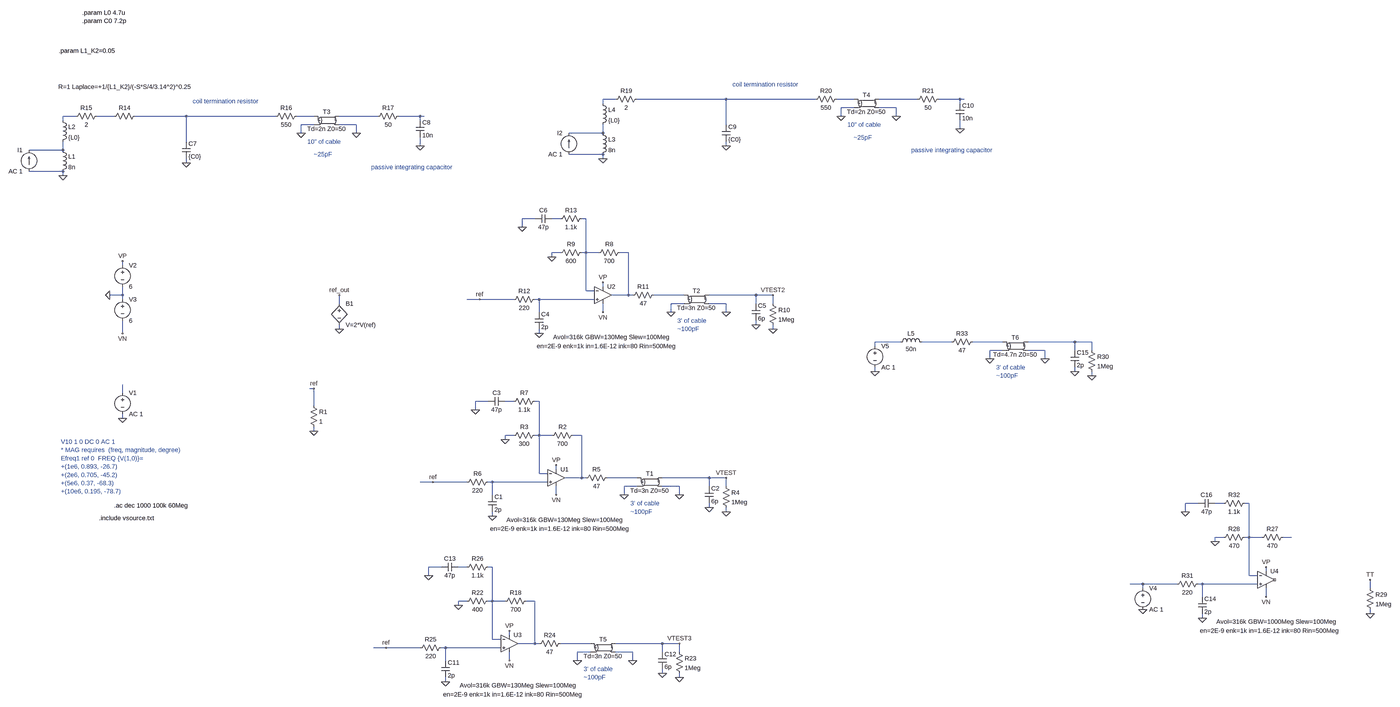
[diagram p0: schematic compensation.asc, whole sheet]
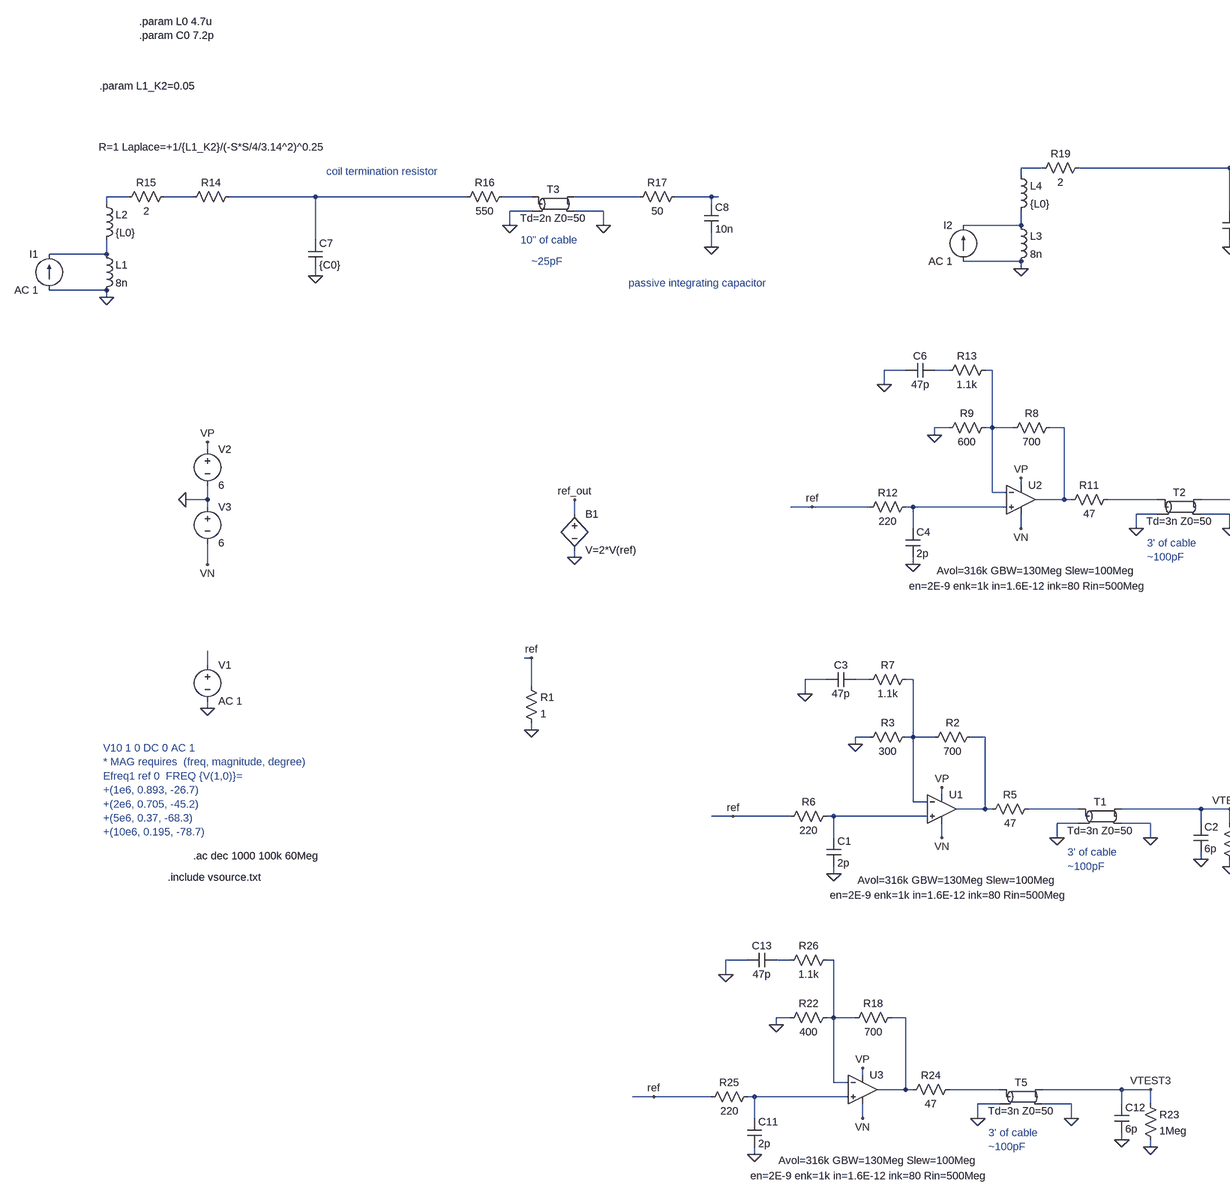
[diagram p1: schematic compensation.asc, part, row 1 of 1, column 1 of 2]
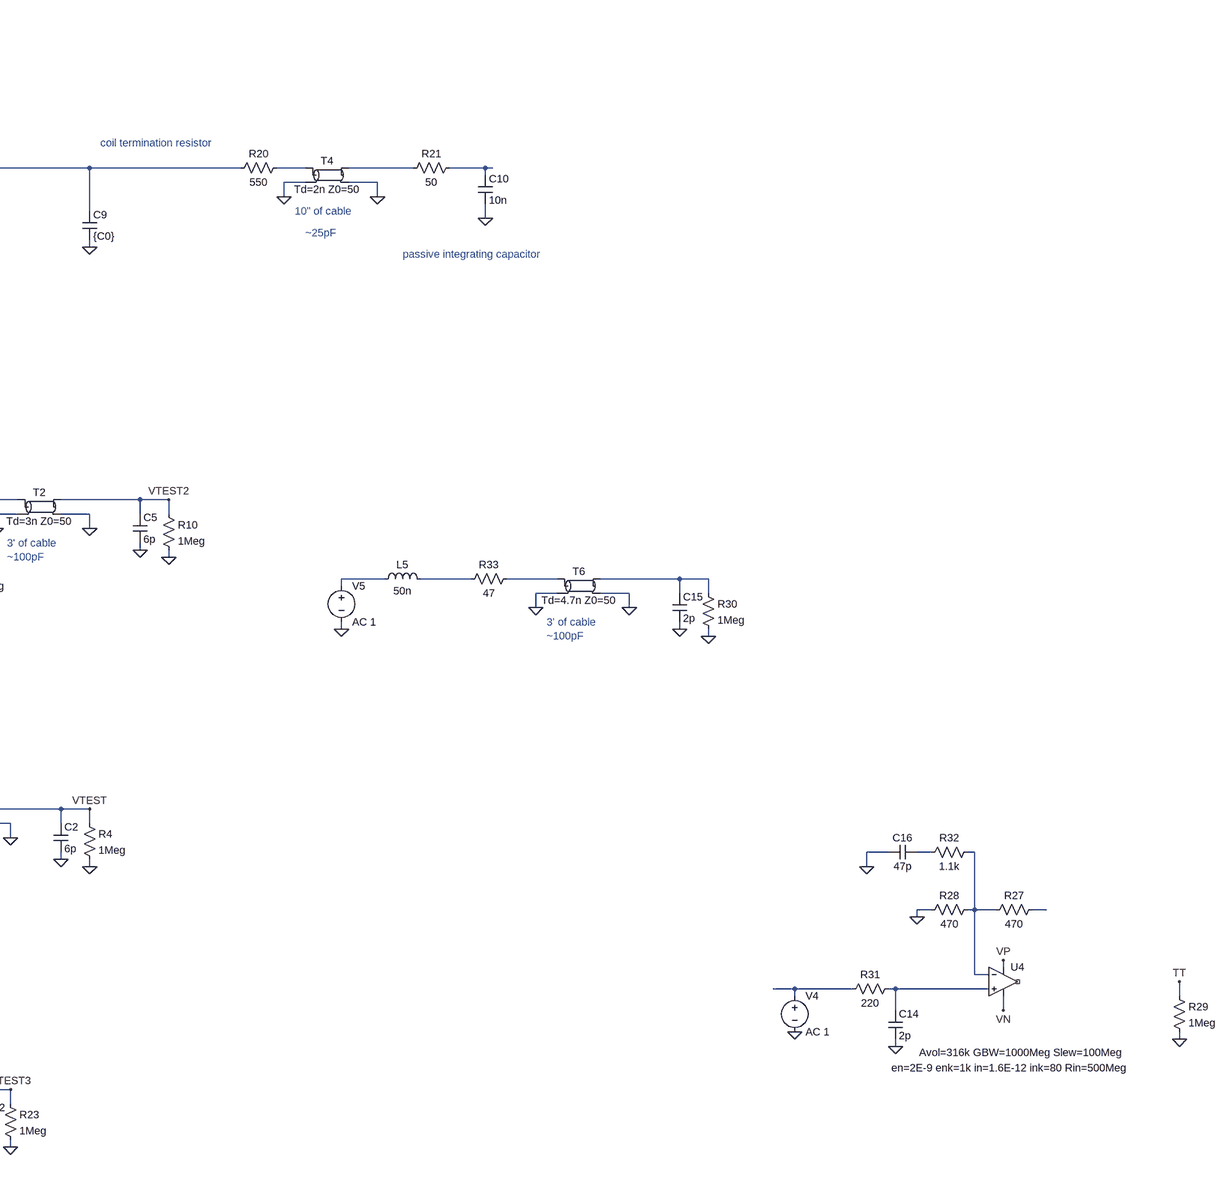
[diagram p2: schematic compensation.asc, part, row 1 of 1, column 2 of 2]
compensation.asc, the LTspice schematic file:
Version 4
SHEET 1 4888 992
WIRE 1712 -1616 1664 -1616
WIRE 2128 -1616 1792 -1616
WIRE 2464 -1616 2128 -1616
WIRE 2608 -1616 2544 -1616
WIRE 2848 -1616 2704 -1616
WIRE 3008 -1616 2928 -1616
WIRE 3024 -1616 3008 -1616
WIRE 1664 -1600 1664 -1616
WIRE 3008 -1600 3008 -1616
WIRE 2608 -1584 2560 -1584
WIRE 2768 -1584 2704 -1584
WIRE -320 -1552 -368 -1552
WIRE -176 -1552 -240 -1552
WIRE 96 -1552 -96 -1552
WIRE 432 -1552 96 -1552
WIRE 576 -1552 512 -1552
WIRE 816 -1552 672 -1552
WIRE 976 -1552 896 -1552
WIRE 992 -1552 976 -1552
WIRE 2560 -1552 2560 -1584
WIRE 2768 -1552 2768 -1584
WIRE -368 -1536 -368 -1552
WIRE 976 -1536 976 -1552
WIRE 576 -1520 528 -1520
WIRE 736 -1520 672 -1520
WIRE 2128 -1520 2128 -1616
WIRE 3008 -1504 3008 -1536
WIRE 528 -1488 528 -1520
WIRE 736 -1488 736 -1520
WIRE 1664 -1488 1664 -1520
WIRE 1664 -1488 1536 -1488
WIRE 96 -1456 96 -1552
WIRE 976 -1440 976 -1472
WIRE 2128 -1440 2128 -1456
WIRE -368 -1424 -368 -1456
WIRE -368 -1424 -496 -1424
WIRE 1664 -1408 1536 -1408
WIRE 1664 -1392 1664 -1408
WIRE 96 -1376 96 -1392
WIRE -368 -1344 -496 -1344
WIRE -368 -1328 -368 -1344
WIRE 1408 -816 1360 -816
WIRE 1504 -816 1472 -816
WIRE 1600 -816 1584 -816
WIRE 1360 -784 1360 -816
WIRE 1504 -688 1472 -688
WIRE 1600 -688 1600 -816
WIRE 1600 -688 1584 -688
WIRE 1648 -688 1600 -688
WIRE 1760 -688 1728 -688
WIRE 1472 -672 1472 -688
WIRE -144 -640 -144 -656
WIRE 1664 -560 1664 -576
WIRE 1600 -544 1600 -688
WIRE 1632 -544 1600 -544
WIRE -144 -528 -144 -560
WIRE -144 -528 -192 -528
WIRE 1760 -528 1760 -688
WIRE 1760 -528 1696 -528
WIRE 1776 -528 1760 -528
WIRE 1968 -528 1856 -528
WIRE 2240 -528 2064 -528
WIRE 2304 -528 2240 -528
WIRE -144 -512 -144 -528
WIRE 1200 -512 1152 -512
WIRE 1328 -512 1200 -512
WIRE 1424 -512 1408 -512
WIRE 1632 -512 1424 -512
WIRE 672 -496 672 -528
WIRE 1968 -496 1920 -496
WIRE 2128 -496 2064 -496
WIRE 2240 -496 2240 -528
WIRE 2304 -496 2304 -528
WIRE 1424 -464 1424 -512
WIRE 1664 -464 1664 -496
WIRE 1920 -464 1920 -496
WIRE 2128 -464 2128 -496
WIRE 2240 -416 2240 -432
WIRE 672 -400 672 -416
WIRE 2304 -400 2304 -416
WIRE -144 -384 -144 -432
WIRE 1424 -384 1424 -400
WIRE 2784 -352 2688 -352
WIRE 2976 -352 2864 -352
WIRE 3168 -352 3056 -352
WIRE 3440 -352 3264 -352
WIRE 3504 -352 3440 -352
WIRE 2688 -336 2688 -352
WIRE 3168 -320 3120 -320
WIRE 3328 -320 3264 -320
WIRE 3440 -320 3440 -352
WIRE 3504 -320 3504 -352
WIRE 3120 -288 3120 -320
WIRE 3328 -288 3328 -320
WIRE 2688 -240 2688 -256
WIRE 3440 -240 3440 -256
WIRE 3504 -224 3504 -240
WIRE 576 -176 560 -176
WIRE -144 -160 -144 -192
WIRE 1232 -128 1184 -128
WIRE 1328 -128 1296 -128
WIRE 1424 -128 1408 -128
WIRE 576 -112 576 -176
WIRE 1184 -96 1184 -128
WIRE -144 -64 -144 -80
WIRE 576 -16 576 -32
WIRE 1328 0 1296 0
WIRE 1424 0 1424 -128
WIRE 1424 0 1408 0
WIRE 1472 0 1424 0
WIRE 1584 0 1552 0
WIRE 1296 16 1296 0
WIRE 1488 128 1488 112
WIRE 1424 144 1424 0
WIRE 1456 144 1424 144
WIRE 1584 160 1584 0
WIRE 1584 160 1520 160
WIRE 1600 160 1584 160
WIRE 1792 160 1680 160
WIRE 2064 160 1888 160
WIRE 2128 160 2064 160
WIRE 1024 176 976 176
WIRE 1152 176 1024 176
WIRE 1248 176 1232 176
WIRE 1456 176 1248 176
WIRE 1792 192 1744 192
WIRE 1952 192 1888 192
WIRE 2064 192 2064 160
WIRE 2128 192 2128 160
WIRE 1248 224 1248 176
WIRE 1488 224 1488 192
WIRE 1744 224 1744 192
WIRE 1952 224 1952 192
WIRE 3904 256 3856 256
WIRE 4000 256 3968 256
WIRE 4096 256 4080 256
WIRE 2064 272 2064 256
WIRE 2128 288 2128 272
WIRE 3856 288 3856 256
WIRE 1248 304 1248 288
WIRE 4000 384 3968 384
WIRE 4096 384 4096 256
WIRE 4096 384 4080 384
WIRE 4144 384 4096 384
WIRE 4256 384 4224 384
WIRE 3968 400 3968 384
WIRE 1056 496 1008 496
WIRE 1152 496 1120 496
WIRE 1248 496 1232 496
WIRE 4160 512 4160 496
WIRE 1008 528 1008 496
WIRE 4096 528 4096 384
WIRE 4128 528 4096 528
WIRE 3696 560 3648 560
WIRE 3824 560 3696 560
WIRE 3920 560 3904 560
WIRE 4128 560 3920 560
WIRE 3696 576 3696 560
WIRE 4800 576 4800 544
WIRE 3920 608 3920 560
WIRE 4160 608 4160 576
WIRE 1152 624 1120 624
WIRE 1248 624 1248 496
WIRE 1248 624 1232 624
WIRE 1296 624 1248 624
WIRE 1408 624 1376 624
WIRE 1120 640 1120 624
WIRE 4800 672 4800 656
WIRE 3920 688 3920 672
WIRE 1312 752 1312 736
WIRE 1248 768 1248 624
WIRE 1280 768 1248 768
WIRE 1408 784 1408 624
WIRE 1408 784 1344 784
WIRE 1424 784 1408 784
WIRE 1616 784 1504 784
WIRE 1888 784 1712 784
WIRE 1952 784 1888 784
WIRE 848 800 800 800
WIRE 976 800 848 800
WIRE 1072 800 1056 800
WIRE 1280 800 1072 800
WIRE 1616 816 1568 816
WIRE 1776 816 1712 816
WIRE 1888 816 1888 784
WIRE 1952 816 1952 784
WIRE 1072 848 1072 800
WIRE 1312 848 1312 816
WIRE 1568 848 1568 816
WIRE 1776 848 1776 816
WIRE 1888 896 1888 880
WIRE 1952 912 1952 896
WIRE 1072 928 1072 912
FLAG -144 -64 0
FLAG 576 -16 0
FLAG 576 -176 ref
FLAG 1488 112 VP
FLAG 1488 224 VN
FLAG 1248 304 0
FLAG 1296 16 0
FLAG 2128 160 VTEST
FLAG 1744 224 0
FLAG 1952 224 0
FLAG 2064 272 0
FLAG 2128 288 0
FLAG 1184 -96 0
FLAG 1024 176 ref
FLAG -192 -528 0
FLAG -144 -656 VP
FLAG -144 -384 VN
FLAG 672 -400 0
FLAG 672 -528 ref_out
FLAG 1664 -576 VP
FLAG 1664 -464 VN
FLAG 1424 -384 0
FLAG 1472 -672 0
FLAG 2304 -528 VTEST2
FLAG 1920 -464 0
FLAG 2128 -464 0
FLAG 2240 -416 0
FLAG 2304 -400 0
FLAG 1360 -784 0
FLAG 1200 -512 ref
FLAG 96 -1376 0
FLAG -368 -1328 0
FLAG 528 -1488 0
FLAG 736 -1488 0
FLAG 976 -1440 0
FLAG 2128 -1440 0
FLAG 1664 -1392 0
FLAG 2560 -1552 0
FLAG 2768 -1552 0
FLAG 3008 -1504 0
FLAG 1312 736 VP
FLAG 1312 848 VN
FLAG 1072 928 0
FLAG 1120 640 0
FLAG 1952 784 VTEST3
FLAG 1568 848 0
FLAG 1776 848 0
FLAG 1888 896 0
FLAG 1952 912 0
FLAG 1008 528 0
FLAG 848 800 ref
FLAG 4160 496 VP
FLAG 4160 608 VN
FLAG 3920 688 0
FLAG 3968 400 0
FLAG 4800 544 TT
FLAG 4800 672 0
FLAG 3856 288 0
FLAG 3696 656 0
FLAG 3120 -288 0
FLAG 3328 -288 0
FLAG 3440 -240 0
FLAG 3504 -224 0
FLAG 2688 -240 0
SYMBOL voltage -144 -176 R0
WINDOW 123 0 0 Left 0
WINDOW 39 0 0 Left 0
SYMATTR InstName V1
SYMATTR Value AC 1
SYMBOL res 560 -128 R0
SYMATTR InstName R1
SYMATTR Value 1
SYMBOL cap 1232 224 R0
SYMATTR InstName C1
SYMATTR Value 2p
SYMBOL res 1568 -16 R90
WINDOW 0 0 56 VBottom 2
WINDOW 3 32 56 VTop 2
SYMATTR InstName R2
SYMATTR Value 700
SYMBOL res 1424 -16 R90
WINDOW 0 0 56 VBottom 2
WINDOW 3 32 56 VTop 2
SYMATTR InstName R3
SYMATTR Value 300
SYMBOL tline 1840 176 R0
SYMATTR InstName T1
SYMATTR Value Td=3n Z0=50
SYMBOL res 2112 176 R0
SYMATTR InstName R4
SYMATTR Value 1Meg
SYMBOL cap 2048 192 R0
SYMATTR InstName C2
SYMATTR Value 6p
SYMBOL res 1696 144 R90
WINDOW 0 0 56 VBottom 2
WINDOW 3 32 56 VTop 2
SYMATTR InstName R5
SYMATTR Value 47
SYMBOL OpAmps\\UniversalOpamp2 1488 160 R0
WINDOW 123 -187 158 Left 2
WINDOW 40 -249 192 Left 2
SYMATTR Value2 Avol=316k GBW=130Meg Slew=100Meg
SYMATTR SpiceLine2 en=2E-9 enk=1k in=1.6E-12 ink=80 Rin=500Meg
SYMATTR InstName U1
SYMATTR SpiceLine ilimit=80m rail=0 Vos=0 phimargin=45
SYMBOL res 1248 160 R90
WINDOW 0 0 56 VBottom 2
WINDOW 3 32 56 VTop 2
SYMATTR InstName R6
SYMATTR Value 220
SYMBOL res 1424 -144 R90
WINDOW 0 0 56 VBottom 2
WINDOW 3 32 56 VTop 2
SYMATTR InstName R7
SYMATTR Value 1.1k
SYMBOL cap 1296 -144 R90
WINDOW 0 0 32 VBottom 2
WINDOW 3 32 32 VTop 2
SYMATTR InstName C3
SYMATTR Value 47p
SYMBOL voltage -144 -656 R0
WINDOW 123 0 0 Left 0
WINDOW 39 0 0 Left 0
SYMATTR InstName V2
SYMATTR Value 6
SYMBOL voltage -144 -528 R0
WINDOW 123 0 0 Left 0
WINDOW 39 0 0 Left 0
SYMATTR InstName V3
SYMATTR Value 6
SYMBOL bv 672 -512 R0
SYMATTR InstName B1
SYMATTR Value V=2*V(ref)
SYMBOL cap 1408 -464 R0
SYMATTR InstName C4
SYMATTR Value 2p
SYMBOL res 1744 -704 R90
WINDOW 0 0 56 VBottom 2
WINDOW 3 32 56 VTop 2
SYMATTR InstName R8
SYMATTR Value 700
SYMBOL res 1600 -704 R90
WINDOW 0 0 56 VBottom 2
WINDOW 3 32 56 VTop 2
SYMATTR InstName R9
SYMATTR Value 600
SYMBOL tline 2016 -512 R0
SYMATTR InstName T2
SYMATTR Value Td=3n Z0=50
SYMBOL res 2288 -512 R0
SYMATTR InstName R10
SYMATTR Value 1Meg
SYMBOL cap 2224 -496 R0
SYMATTR InstName C5
SYMATTR Value 6p
SYMBOL res 1872 -544 R90
WINDOW 0 0 56 VBottom 2
WINDOW 3 32 56 VTop 2
SYMATTR InstName R11
SYMATTR Value 47
SYMBOL OpAmps\\UniversalOpamp2 1664 -528 R0
WINDOW 123 -187 158 Left 2
WINDOW 40 -249 192 Left 2
SYMATTR Value2 Avol=316k GBW=130Meg Slew=100Meg
SYMATTR SpiceLine2 en=2E-9 enk=1k in=1.6E-12 ink=80 Rin=500Meg
SYMATTR InstName U2
SYMATTR SpiceLine ilimit=80m rail=0 Vos=0 phimargin=45
SYMBOL res 1424 -528 R90
WINDOW 0 0 56 VBottom 2
WINDOW 3 32 56 VTop 2
SYMATTR InstName R12
SYMATTR Value 220
SYMBOL res 1600 -832 R90
WINDOW 0 0 56 VBottom 2
WINDOW 3 32 56 VTop 2
SYMATTR InstName R13
SYMATTR Value 1.1k
SYMBOL cap 1472 -832 R90
WINDOW 0 0 32 VBottom 2
WINDOW 3 32 32 VTop 2
SYMATTR InstName C6
SYMATTR Value 47p
SYMBOL res -80 -1568 R90
WINDOW 0 0 56 VBottom 2
WINDOW 3 -110 55 VTop 2
SYMATTR InstName R14
SYMATTR Value R=1 Laplace=+1/{L1_K2}/(-S*S/4/3.14^2)^0.25
SYMBOL res -224 -1568 R90
WINDOW 0 0 56 VBottom 2
WINDOW 3 32 56 VTop 2
SYMATTR InstName R15
SYMATTR Value 2
SYMBOL ind -384 -1440 R0
SYMATTR InstName L1
SYMATTR Value 8n
SYMATTR SpiceLine Rser=0
SYMBOL ind -384 -1552 R0
SYMATTR InstName L2
SYMATTR Value {L0}
SYMBOL cap 80 -1456 R0
SYMATTR InstName C7
SYMATTR Value {C0}
SYMBOL res 528 -1568 R90
WINDOW 0 0 56 VBottom 2
WINDOW 3 32 56 VTop 2
SYMATTR InstName R16
SYMATTR Value 550
SYMBOL res 912 -1568 R90
WINDOW 0 0 56 VBottom 2
WINDOW 3 32 56 VTop 2
SYMATTR InstName R17
SYMATTR Value 50
SYMBOL tline 624 -1536 R0
SYMATTR InstName T3
SYMATTR Value Td=2n Z0=50
SYMBOL cap 960 -1536 R0
SYMATTR InstName C8
SYMATTR Value 10n
SYMBOL current -496 -1344 R180
WINDOW 0 24 80 Left 2
WINDOW 3 24 0 Left 2
WINDOW 123 0 0 Left 0
WINDOW 39 0 0 Left 0
SYMATTR InstName I1
SYMATTR Value AC 1
SYMBOL res 1808 -1632 R90
WINDOW 0 0 56 VBottom 2
WINDOW 3 32 56 VTop 2
SYMATTR InstName R19
SYMATTR Value 2
SYMBOL ind 1648 -1504 R0
SYMATTR InstName L3
SYMATTR Value 8n
SYMATTR SpiceLine Rser=0
SYMBOL ind 1648 -1616 R0
SYMATTR InstName L4
SYMATTR Value {L0}
SYMBOL cap 2112 -1520 R0
SYMATTR InstName C9
SYMATTR Value {C0}
SYMBOL res 2560 -1632 R90
WINDOW 0 0 56 VBottom 2
WINDOW 3 32 56 VTop 2
SYMATTR InstName R20
SYMATTR Value 550
SYMBOL res 2944 -1632 R90
WINDOW 0 0 56 VBottom 2
WINDOW 3 32 56 VTop 2
SYMATTR InstName R21
SYMATTR Value 50
SYMBOL tline 2656 -1600 R0
SYMATTR InstName T4
SYMATTR Value Td=2n Z0=50
SYMBOL cap 2992 -1600 R0
SYMATTR InstName C10
SYMATTR Value 10n
SYMBOL current 1536 -1408 R180
WINDOW 0 24 80 Left 2
WINDOW 3 24 0 Left 2
WINDOW 123 0 0 Left 0
WINDOW 39 0 0 Left 0
SYMATTR InstName I2
SYMATTR Value AC 1
SYMBOL cap 1056 848 R0
SYMATTR InstName C11
SYMATTR Value 2p
SYMBOL res 1392 608 R90
WINDOW 0 0 56 VBottom 2
WINDOW 3 32 56 VTop 2
SYMATTR InstName R18
SYMATTR Value 700
SYMBOL res 1248 608 R90
WINDOW 0 0 56 VBottom 2
WINDOW 3 32 56 VTop 2
SYMATTR InstName R22
SYMATTR Value 400
SYMBOL tline 1664 800 R0
SYMATTR InstName T5
SYMATTR Value Td=3n Z0=50
SYMBOL res 1936 800 R0
SYMATTR InstName R23
SYMATTR Value 1Meg
SYMBOL cap 1872 816 R0
SYMATTR InstName C12
SYMATTR Value 6p
SYMBOL res 1520 768 R90
WINDOW 0 0 56 VBottom 2
WINDOW 3 32 56 VTop 2
SYMATTR InstName R24
SYMATTR Value 47
SYMBOL OpAmps\\UniversalOpamp2 1312 784 R0
WINDOW 123 -187 158 Left 2
WINDOW 40 -249 192 Left 2
SYMATTR Value2 Avol=316k GBW=130Meg Slew=100Meg
SYMATTR SpiceLine2 en=2E-9 enk=1k in=1.6E-12 ink=80 Rin=500Meg
SYMATTR InstName U3
SYMATTR SpiceLine ilimit=80m rail=0 Vos=0 phimargin=45
SYMBOL res 1072 784 R90
WINDOW 0 0 56 VBottom 2
WINDOW 3 32 56 VTop 2
SYMATTR InstName R25
SYMATTR Value 220
SYMBOL res 1248 480 R90
WINDOW 0 0 56 VBottom 2
WINDOW 3 32 56 VTop 2
SYMATTR InstName R26
SYMATTR Value 1.1k
SYMBOL cap 1120 480 R90
WINDOW 0 0 32 VBottom 2
WINDOW 3 32 32 VTop 2
SYMATTR InstName C13
SYMATTR Value 47p
SYMBOL cap 3904 608 R0
SYMATTR InstName C14
SYMATTR Value 2p
SYMBOL res 4240 368 R90
WINDOW 0 0 56 VBottom 2
WINDOW 3 32 56 VTop 2
SYMATTR InstName R27
SYMATTR Value 470
SYMBOL res 4096 368 R90
WINDOW 0 0 56 VBottom 2
WINDOW 3 32 56 VTop 2
SYMATTR InstName R28
SYMATTR Value 470
SYMBOL res 4784 560 R0
SYMATTR InstName R29
SYMATTR Value 1Meg
SYMBOL OpAmps\\UniversalOpamp2 4160 544 R0
WINDOW 123 -187 158 Left 2
WINDOW 40 -249 192 Left 2
SYMATTR Value2 Avol=316k GBW=1000Meg Slew=100Meg
SYMATTR SpiceLine2 en=2E-9 enk=1k in=1.6E-12 ink=80 Rin=500Meg
SYMATTR InstName U4
SYMATTR SpiceLine ilimit=80m rail=0 Vos=0 phimargin=45
SYMBOL res 3920 544 R90
WINDOW 0 0 56 VBottom 2
WINDOW 3 32 56 VTop 2
SYMATTR InstName R31
SYMATTR Value 220
SYMBOL res 4096 240 R90
WINDOW 0 0 56 VBottom 2
WINDOW 3 32 56 VTop 2
SYMATTR InstName R32
SYMATTR Value 1.1k
SYMBOL cap 3968 240 R90
WINDOW 0 0 32 VBottom 2
WINDOW 3 32 32 VTop 2
SYMATTR InstName C16
SYMATTR Value 47p
SYMBOL voltage 3696 560 R0
WINDOW 123 0 0 Left 0
WINDOW 39 0 0 Left 0
SYMATTR InstName V4
SYMATTR Value AC 1
SYMBOL tline 3216 -336 R0
SYMATTR InstName T6
SYMATTR Value Td=4.7n Z0=50
SYMBOL res 3488 -336 R0
SYMATTR InstName R30
SYMATTR Value 1Meg
SYMBOL cap 3424 -320 R0
SYMATTR InstName C15
SYMATTR Value 2p
SYMBOL res 3072 -368 R90
WINDOW 0 0 56 VBottom 2
WINDOW 3 32 56 VTop 2
SYMATTR InstName R33
SYMATTR Value 47
SYMBOL voltage 2688 -352 R0
WINDOW 123 0 0 Left 0
WINDOW 39 0 0 Left 0
SYMATTR InstName V5
SYMATTR Value AC 1
SYMBOL ind 2768 -336 R270
WINDOW 0 32 56 VTop 2
WINDOW 3 5 56 VBottom 2
SYMATTR InstName L5
SYMATTR Value 50n
TEXT -376 24 Left 2 ;V10 1 0 DC 0 AC 1\n* MAG requires  (freq, magnitude, degree)\nEfreq1 ref 0  FREQ {V(1,0)}=\n+(1e6, 0.893, -26.7)\n+(2e6, 0.705, -45.2)  \n+(5e6, 0.37, -68.3)\n+(10e6, 0.195, -78.7)
TEXT -176 264 Left 2 !.ac dec 1000 100k 60Meg
TEXT -232 312 Left 2 !.include vsource.txt
TEXT 1768 256 Left 2 ;3' of cable\n~100pF
TEXT 1944 -432 Left 2 ;3' of cable\n~100pF
TEXT 552 -1456 Left 2 ;10" of cable
TEXT 120 -1608 Left 2 ;coil termination resistor
TEXT 792 -1360 Left 2 ;passive integrating capacitor
TEXT 576 -1408 Left 2 ;~25pF
TEXT -384 -1848 Left 2 !.param L1_K2=0.05
TEXT -296 -1992 Left 2 !.param L0 4.7u\n.param C0 7.2p
TEXT 2584 -1520 Left 2 ;10" of cable
TEXT 2152 -1672 Left 2 ;coil termination resistor
TEXT 2824 -1424 Left 2 ;passive integrating capacitor
TEXT 2608 -1472 Left 2 ;~25pF
TEXT 1592 880 Left 2 ;3' of cable\n~100pF
TEXT 3144 -256 Left 2 ;3' of cable\n~100pF

The netlist it stands for:
* compensation.asc
V1 N023 0 AC 1
R1 ref 0 1
C1 N028 0 2p
R2 N026 N025 700
R3 N025 0 300
T1 N027 0 VTEST 0 Td=3n Z0=50
R4 VTEST 0 1Meg
C2 VTEST 0 6p
R5 N027 N026 47
XU1 N028 N025 VP VN N026 level.2 Avol=316k GBW=130Meg Slew=100Meg ilimit=80m rail=0 Vos=0 phimargin=45 en=2E-9 enk=1k in=1.6E-12 ink=80 Rin=500Meg  ; pins IN+ IN- V+ V- OUT
R6 N028 ref 220
R7 N025 N024 1.1k
C3 N024 0 47p
V2 VP 0 6
V3 0 VN 6
B1 ref_out 0 V=2*V(ref)
C4 N018 0 2p
R8 N016 N015 700
R9 N015 0 600
T2 N017 0 VTEST2 0 Td=3n Z0=50
R10 VTEST2 0 1Meg
C5 VTEST2 0 6p
R11 N017 N016 47
XU2 N018 N015 VP VN N016 level.2 Avol=316k GBW=130Meg Slew=100Meg ilimit=80m rail=0 Vos=0 phimargin=45 en=2E-9 enk=1k in=1.6E-12 ink=80 Rin=500Meg  ; pins IN+ IN- V+ V- OUT
R12 N018 ref 220
R13 N015 N014 1.1k
C6 N014 0 47p
R14 N008 N007 R=1 Laplace=+1/{L1_K2}/(-S*S/4/3.14^2)^0.25
R15 N007 N006 2
L1 N013 0 8n Rser=0
L2 N006 N013 {L0}
C7 N008 0 {C0}
R16 N009 N008 550
R17 N011 N010 50
T3 N009 0 N010 0 Td=2n Z0=50
C8 N011 0 10n
I1 0 N013 AC 1
R19 N002 N001 2
L3 N012 0 8n Rser=0
L4 N001 N012 {L0}
C9 N002 0 {C0}
R20 N003 N002 550
R21 N005 N004 50
T4 N003 0 N004 0 Td=2n Z0=50
C10 N005 0 10n
I2 0 N012 AC 1
C11 N038 0 2p
R18 N036 N033 700
R22 N033 0 400
T5 N037 0 VTEST3 0 Td=3n Z0=50
R23 VTEST3 0 1Meg
C12 VTEST3 0 6p
R24 N037 N036 47
XU3 N038 N033 VP VN N036 level.2 Avol=316k GBW=130Meg Slew=100Meg ilimit=80m rail=0 Vos=0 phimargin=45 en=2E-9 enk=1k in=1.6E-12 ink=80 Rin=500Meg  ; pins IN+ IN- V+ V- OUT
R25 N038 ref 220
R26 N033 N032 1.1k
C13 N032 0 47p
C14 N035 0 2p
R27 N031 N030 470
R28 N030 0 470
R29 TT 0 1Meg
XU4 N035 N030 VP VN NC_01 level.2 Avol=316k GBW=1000Meg Slew=100Meg ilimit=80m rail=0 Vos=0 phimargin=45 en=2E-9 enk=1k in=1.6E-12 ink=80 Rin=500Meg  ; pins IN+ IN- V+ V- OUT
R31 N035 N034 220
R32 N030 N029 1.1k
C16 N029 0 47p
V4 N034 0 AC 1
T6 N021 0 N022 0 Td=4.7n Z0=50
R30 N022 0 1Meg
C15 N022 0 2p
R33 N021 N020 47
V5 N019 0 AC 1
L5 N019 N020 50n
* V10 1 0 DC 0 AC 1
* * MAG requires  (freq, magnitude, degree)
* Efreq1 ref 0  FREQ {V(1,0)}=
* +(1e6, 0.893, -26.7)
* +(2e6, 0.705, -45.2)
* +(5e6, 0.37, -68.3)
* +(10e6, 0.195, -78.7)
.ac dec 1000 100k 60Meg
.include vsource.txt
* 3' of cable
* ~100pF
* 3' of cable
* ~100pF
* 10" of cable
* coil termination resistor
* passive integrating capacitor
* ~25pF
.param L1_K2=0.05
.param L0 4.7u
.param C0 7.2p
* 10" of cable
* coil termination resistor
* passive integrating capacitor
* ~25pF
* 3' of cable
* ~100pF
* 3' of cable
* ~100pF
.lib UniversalOpamps2.sub
.backanno
.end